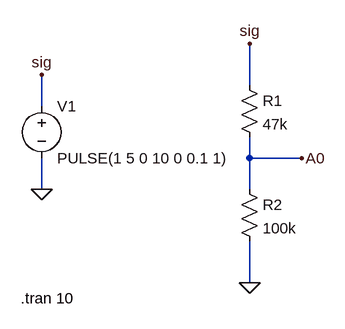
[diagram p0: schematic VoltageScale.asc]
VoltageScale.asc, the LTspice schematic file:
Version 4
SHEET 1 880 680
WIRE 352 112 352 48
WIRE 32 144 32 96
WIRE 352 224 352 192
WIRE 432 224 352 224
WIRE 32 272 32 224
WIRE 352 272 352 224
WIRE 352 416 352 352
FLAG 32 96 sig
FLAG 32 272 0
FLAG 352 48 sig
FLAG 432 224 A0
FLAG 352 416 0
SYMBOL voltage 32 128 R0
WINDOW 123 0 0 Left 0
WINDOW 39 0 0 Left 0
SYMATTR InstName V1
SYMATTR Value PULSE(1 5 0 10 0 0.1 1)
SYMBOL res 336 96 R0
SYMATTR InstName R1
SYMATTR Value 47k
SYMBOL res 336 256 R0
SYMATTR InstName R2
SYMATTR Value 100k
TEXT 0 440 Left 2 !.tran 10

The netlist it stands for:
* VoltageScale.asc
V1 sig 0 PULSE(1 5 0 10 0 0.1 1)
R1 sig A0 47k
R2 A0 0 100k
.tran 10
.backanno
.end

* Results of the author's LTspice run, read from the files saved beside the schematic
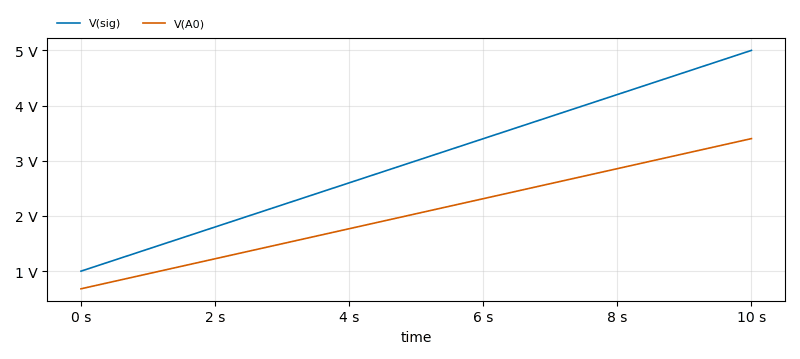
[diagram p1: Transient Analysis of VoltageScale.asc, plotted from the saved traces]
* Transient Analysis, 1 run:
*   V(sig): min 1 V, max 5 V, average 3 V, rms 3.58 V, last 5 V
*   V(A0): min 680.3 mV, max 3.401 V, average 2.041 V, rms 2.435 V, last 3.401 V